# Altium schematic sheet Interface.SchDoc
size B; DocumentNumber: 3; SheetNumber: 3; SheetTotal: 9; ENG_APP_DATE: --/--/--; DSN_APP_DATE: --/--/--; CHK_APP_DATE: --/--/--
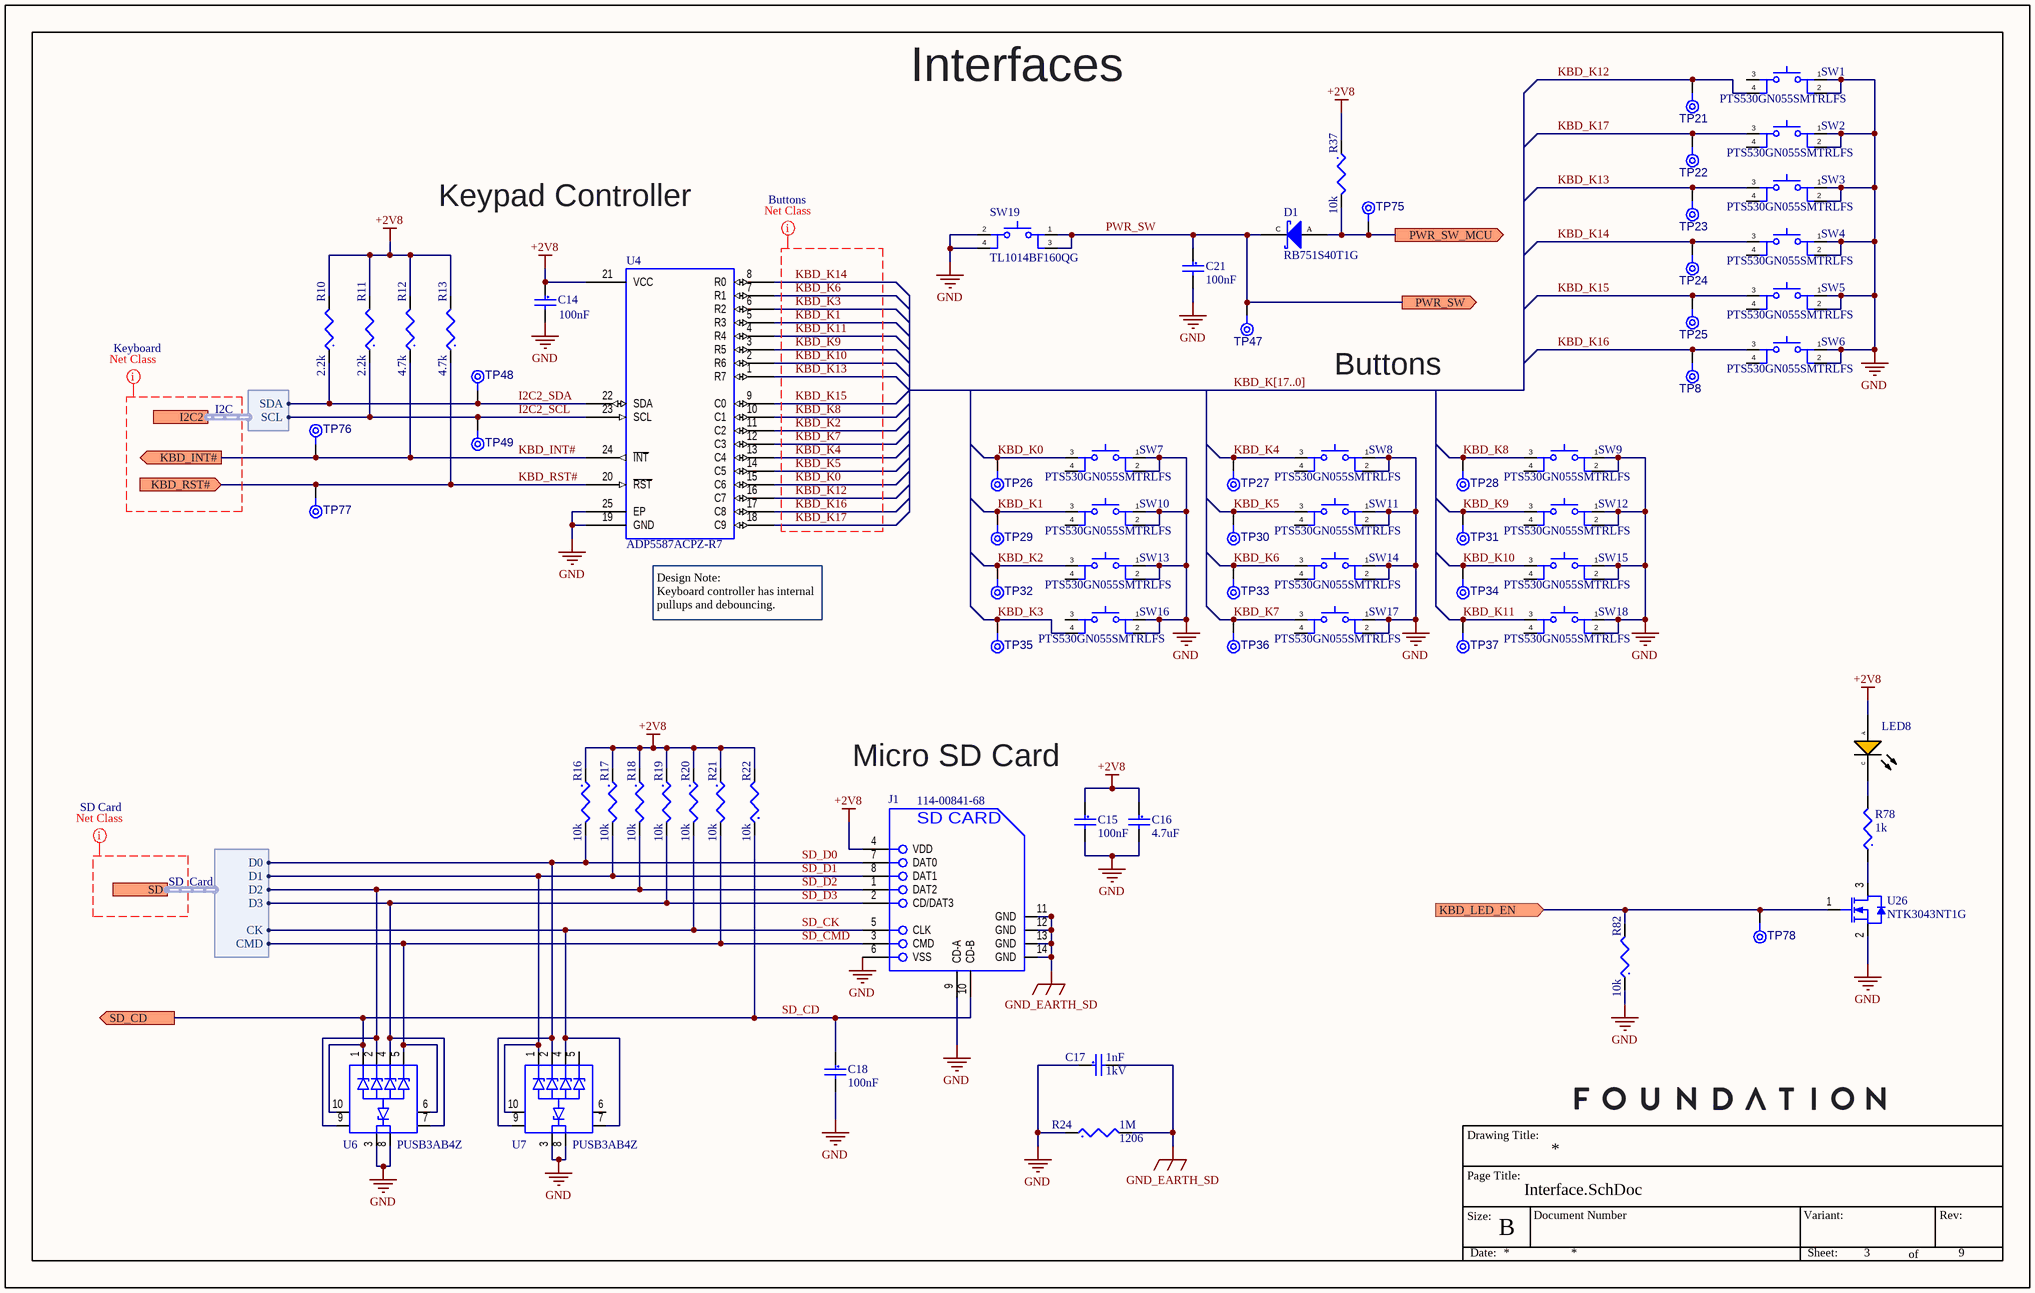
[diagram p0: Interface.SchDoc]

## Parts
C14  Capacitance: 100nF  [CAPC0402(1005)55_L]  (hidden comment: CAP CER 0.1uF 16V 10% X7R 0402)
C15  Capacitance: 100nF  [CAPC0402(1005)55_L]  (hidden comment: CAP CER 0.1uF 16V 10% X7R 0402)
C16  Capacitance: 4.7uF  [CAPC0402(1005)55_L]  (hidden comment: CAP CER 4.7UF 10V 20% X5R 0402)
C17  Capacitance: 1nF  Voltage Rating (DC): 1kV  [CAPC0805(2012)145_N]  (hidden comment: CAP CER 1000pF 1000V 10% X7R 0805)
C18  Capacitance: 100nF  [CAPC0402(1005)55_L]  (hidden comment: CAP CER 0.1uF 16V 10% X7R 0402)
C21  Capacitance: 100nF  [CAPC0402(1005)55_L]  (hidden comment: CAP CER 0.1uF 16V 10% X7R 0402)
D1  RB751S40T1G  [ON - SOD-523_V]
J1  114-00841-68  [AMPH - 114-00841-68_C-1]
LED8  IN-S63AT5A  [LEDC0603(1608)65_L]  (value not drawn)
R10  Resistance: 2.2k  [RESC0402(1005)_L]  (hidden comment: RES 2.2K 1/16W 1% 0402)
R11  Resistance: 2.2k  [RESC0402(1005)_L]  (hidden comment: RES 2.2K 1/16W 1% 0402)
R12  Resistance: 4.7k  [RESC0402(1005)_L]  (hidden comment: RES 4.7K 1/16W 1% 0402)
R13  Resistance: 4.7k  [RESC0402(1005)_L]  (hidden comment: RES 4.7K 1/16W 1% 0402)
R16  Resistance: 10k  [RESC0402(1005)_L]  (hidden comment: RES 10K 1/16W 1% 0402)
R17  Resistance: 10k  [RESC0402(1005)_L]  (hidden comment: RES 10K 1/16W 1% 0402)
R18  Resistance: 10k  [RESC0402(1005)_L]  (hidden comment: RES 10K 1/16W 1% 0402)
R19  Resistance: 10k  [RESC0402(1005)_L]  (hidden comment: RES 10K 1/16W 1% 0402)
R20  Resistance: 10k  [RESC0402(1005)_L]  (hidden comment: RES 10K 1/16W 1% 0402)
R21  Resistance: 10k  [RESC0402(1005)_L]  (hidden comment: RES 10K 1/16W 1% 0402)
R22  Resistance: 10k  [RESC0402(1005)_L]  (hidden comment: RES 10K 1/16W 1% 0402)
R24  Resistance: 1M  Case Code (Imperial): 1206  [RESC1206(3216)_L]  (hidden comment: RES 1.0M 1/4W 5% 1206)
R37  Resistance: 10k  [RESC0402(1005)_L]  (hidden comment: RES 10K 1/16W 1% 0402)
R78  Resistance: 1k  [RESC0402(1005)_L]  (hidden comment: RES 1.0K 1/16W 1% 0402)
R82  Resistance: 10k  [RESC0402(1005)_L]  (hidden comment: RES 10K 1/16W 1% 0402)
SW1  PTS530GN055SMTRLFS  [C&K - PTS530_V]
SW2  PTS530GN055SMTRLFS  [C&K - PTS530_V]
SW3  PTS530GN055SMTRLFS  [C&K - PTS530_V]
SW4  PTS530GN055SMTRLFS  [C&K - PTS530_V]
SW5  PTS530GN055SMTRLFS  [C&K - PTS530_V]
SW6  PTS530GN055SMTRLFS  [C&K - PTS530_V]
SW7  PTS530GN055SMTRLFS  [C&K - PTS530_V]
SW8  PTS530GN055SMTRLFS  [C&K - PTS530_V]
SW9  PTS530GN055SMTRLFS  [C&K - PTS530_V]
SW10  PTS530GN055SMTRLFS  [C&K - PTS530_V]
SW11  PTS530GN055SMTRLFS  [C&K - PTS530_V]
SW12  PTS530GN055SMTRLFS  [C&K - PTS530_V]
SW13  PTS530GN055SMTRLFS  [C&K - PTS530_V]
SW14  PTS530GN055SMTRLFS  [C&K - PTS530_V]
SW15  PTS530GN055SMTRLFS  [C&K - PTS530_V]
SW16  PTS530GN055SMTRLFS  [C&K - PTS530_V]
SW17  PTS530GN055SMTRLFS  [C&K - PTS530_V]
SW18  PTS530GN055SMTRLFS  [C&K - PTS530_V]
SW19  TL1014BF160QG  [E-SWITCH - TL1014BFXXXQG]
TP8  TPAD8R  [TP08R]  (value not drawn)  (no BOM)
TP21  TPAD8R  [TP08R]  (value not drawn)  (no BOM)
TP22  TPAD8R  [TP08R]  (value not drawn)  (no BOM)
TP23  TPAD8R  [TP08R]  (value not drawn)  (no BOM)
TP24  TPAD8R  [TP08R]  (value not drawn)  (no BOM)
TP25  TPAD8R  [TP08R]  (value not drawn)  (no BOM)
TP26  TPAD8R  [TP08R]  (value not drawn)  (no BOM)
TP27  TPAD8R  [TP08R]  (value not drawn)  (no BOM)
TP28  TPAD8R  [TP08R]  (value not drawn)  (no BOM)
TP29  TPAD8R  [TP08R]  (value not drawn)  (no BOM)
TP30  TPAD8R  [TP08R]  (value not drawn)  (no BOM)
TP31  TPAD8R  [TP08R]  (value not drawn)  (no BOM)
TP32  TPAD8R  [TP08R]  (value not drawn)  (no BOM)
TP33  TPAD8R  [TP08R]  (value not drawn)  (no BOM)
TP34  TPAD8R  [TP08R]  (value not drawn)  (no BOM)
TP35  TPAD8R  [TP08R]  (value not drawn)  (no BOM)
TP36  TPAD8R  [TP08R]  (value not drawn)  (no BOM)
TP37  TPAD8R  [TP08R]  (value not drawn)  (no BOM)
TP47  TPAD8R  [TP08R]  (value not drawn)  (no BOM)
TP48  TPAD8R  [TP08R]  (value not drawn)  (no BOM)
TP49  TPAD8R  [TP08R]  (value not drawn)  (no BOM)
TP75  TPAD8R  [TP08R]  (value not drawn)  (no BOM)
TP76  TPAD8R  [TP08R]  (value not drawn)  (no BOM)
TP77  TPAD8R  [TP08R]  (value not drawn)  (no BOM)
TP78  TPAD8R  [TP08R]  (value not drawn)  (no BOM)
U4  ADP5587ACPZ-R7  [ADEV - LFCSP-24_L]
U6  PUSB3AB4Z  [NEXP - DFN2510A-10_L]
U7  PUSB3AB4Z  [NEXP - DFN2510A-10_L]
U26  NTK3043NT1G  [SOT-723-3(40)_N]

## Ports
I2C2 (harness I2C), KBD_INT# (out), KBD_LED_EN (in), KBD_RST# (in), PWR_SW (out), PWR_SW_MCU (out), SD (harness SD_Card), SD_CD (out)

## Harnesses
SD_Card: CK, CMD, D0, D1, D2, D3
I2C: SCL, SDA

## Nets
+2V8: C14.1 C15.1 C16.1 J1.4(VDD) LED8.A R10.2 R11.2 R12.2 R13.2 R16.1 R17.1 R18.1 R19.1 R20.1 R21.1 R22.2 R37.1 U4.21(VCC)
GND: C14.2 C15.2 C16.2 C17.1 C18.2 C21.2 J1.6(VSS) J1.9(CD-A) R24.1 R82.1 SW1.1 SW1.2 SW2.1 SW2.2 SW3.1 SW3.2 SW4.1 SW4.2 SW5.1 SW5.2 SW6.1 SW6.2 SW7.1 SW7.2 SW8.1 SW8.2 SW9.1 SW9.2 SW10.1 SW10.2 SW11.1 SW11.2 SW12.1 SW12.2 SW13.1 SW13.2 SW14.1 SW14.2 SW15.1 SW15.2 SW16.1 SW16.2 SW17.1 SW17.2 SW18.1 SW18.2 SW19.2 SW19.4 U4.19(GND) U4.25(EP) U6.3(DIODE) U6.8(DIODE) U7.3(DIODE) U7.8(DIODE) U26.2(S)
GND_EARTH_SD: C17.2 J1.11(GND) J1.12(GND) J1.13(GND) J1.14(GND) R24.2
I2C2_SCL: R11.1 TP49.1(TP) U4.23(SCL) ; port I2C2.SCL
I2C2_SDA: R10.1 TP48.1(TP) U4.22(SDA) ; port I2C2.SDA
KBD_INT#: R12.1 TP76.1(TP) U4.24(~{INT}) ; port KBD_INT#
KBD_K0: SW7.3 TP26.1(TP) U4.15(C6)
KBD_K1: SW10.3 TP29.1(TP) U4.5(R3)
KBD_K2: SW13.3 TP32.1(TP) U4.11(C2)
KBD_K3: SW16.4 TP35.1(TP) U4.6(R2)
KBD_K4: SW8.3 TP27.1(TP) U4.13(C4)
KBD_K5: SW11.3 TP30.1(TP) U4.14(C5)
KBD_K6: SW14.3 TP33.1(TP) U4.7(R1)
KBD_K7: SW17.3 TP36.1(TP) U4.12(C3)
KBD_K8: SW9.3 TP28.1(TP) U4.10(C1)
KBD_K9: SW12.3 TP31.1(TP) U4.3(R5)
KBD_K10: SW15.3 TP34.1(TP) U4.2(R6)
KBD_K11: SW18.3 TP37.1(TP) U4.4(R4)
KBD_K12: SW1.4 TP21.1(TP) U4.16(C7)
KBD_K13: SW3.3 TP23.1(TP) U4.1(R7)
KBD_K14: SW4.3 TP24.1(TP) U4.8(R0)
KBD_K15: SW5.3 TP25.1(TP) U4.9(C0)
KBD_K16: SW6.3 TP8.1(TP) U4.17(C8)
KBD_K17: SW2.3 TP22.1(TP) U4.18(C9)
KBD_LED_EN: R82.2 TP78.1(TP) U26.1(G) ; port KBD_LED_EN
KBD_RST#: R13.1 TP77.1(TP) U4.20(~{RST}) ; port KBD_RST#
PWR_SW: C21.1 D1.C SW19.1 SW19.3 TP47.1(TP) ; port PWR_SW
PWR_SW_MCU: D1.A R37.2 TP75.1(TP) ; port PWR_SW_MCU
SD_CD: C18.1 J1.10(CD-B) R22.1 U6.1(DIODE) U6.10(DIODE) ; port SD_CD
SD_CK: J1.5(CLK) R20.2 U7.4(DIODE) U7.7(DIODE) ; port SD.CK
SD_CMD: J1.3(CMD) R21.2 U6.5(DIODE) U6.6(DIODE) ; port SD.CMD
SD_D0: J1.7(DAT0) R16.2 U7.2(A) U7.9(DIODE) ; port SD.D0
SD_D1: J1.8(DAT1) R17.2 U7.1(DIODE) U7.10(DIODE) ; port SD.D1
SD_D2: J1.1(DAT2) R18.2 U6.2(A) U6.9(DIODE) ; port SD.D2
SD_D3: J1.2(CD/DAT3) R19.2 U6.4(DIODE) U6.7(DIODE) ; port SD.D3
NetLED8_C: LED8.C R78.2
NetR78_1: R78.1 U26.3(D)

Not connected (* = marked no-connect by the designer): SW1 3; SW2 4; SW3 4; SW4 4; SW5 4; SW6 4; SW7 4; SW8 4; SW9 4; SW10 4; SW11 4; SW12 4; SW13 4; SW14 4; SW15 4; SW16 3; SW17 4; SW18 4; U7 5(DIODE) 6(DIODE)

## Buses and harness runs
bus KBD_K[17..0]

## Layout directives
net class Keyboard: (no net found under the mark)
net class SD Card: (no net found under the mark)
net class Buttons: KBD_K0, KBD_K1, KBD_K2, KBD_K3, KBD_K4, KBD_K5, KBD_K6, KBD_K7, KBD_K8, KBD_K9, KBD_K10, KBD_K11, KBD_K12, KBD_K13, KBD_K14, KBD_K15, KBD_K16, KBD_K17

## Notes on the sheet
- Interfaces
- Keypad Controller
- Buttons
- (near U4) Design Note:
  Keyboard controller has internal pullups and debouncing.
- Micro SD Card
- Drawing Title:
- Page Title:
- Size:
- B
- Document Number
- Variant:
- Rev:
- Date:
- Sheet:
- of
- (in symbol CMP-CON-0078-2) SD CARD

## Library data of the parts
C14 C15 C18 C21 = CMP-CAP-00002-2: 0.1µF ±10% 16V Ceramic Capacitor X7R 0402 (1005 Metric); Insulation Resistance: 10GR; Material: Ceramic; Tolerance: 10%; REACH SVHC: No SVHC; Radiation Hardening: No; Case Code (Metric): 1005; Height: 0.5mm; Depth: 0.5mm; Min Operating Temperature: -55°C; Max Operating Temperature: 125°C; Lead Free: Lead Free; Thickness: 0.022inch; Length: 1mm; Voltage Rating (DC): 16V; Dielectric Material: Ceramic; Packaging: Tape and Reel; Case/Package: 0402; Width: 0.5mm; Termination: SMD/SMT; Voltage Rating: 16V; Mount: Surface Mount; Case Code (Imperial): 0402; Package Quantity: 1; Dielectric: X7R; Number of Pins: 2; Voltage: 16V
C16 = CMP-CAP-00038-1: 4.7µF ±20% 10V Ceramic Capacitor X5R 0402 (1005 Metric); Length: 1mm; Termination: SMD/SMT; Max Operating Temperature: 85°C; Case Code (Imperial): 0402; Height: 0.5mm; Voltage Rating: 10V; Composition: Ceramic; Dielectric: X5R; Voltage Rating (DC): 10V; REACH SVHC: No SVHC; Case Code (Metric): 1005; Tolerance: 20%; Case/Package: 0402; Min Operating Temperature: -55°C; Width: 0.02inch; Mount: Surface Mount; Packaging: Tape and Reel; Package Quantity: 1; Thickness: 500um; Radiation Hardening: No; Voltage: 10V; Depth: 0.5mm; Weight: 2.3E-05oz; Dielectric Material: Ceramic; Lead Free: Lead Free
C17 = CMP-CAP-00004-1: 1000pF ±10% 1000V (1kV) Ceramic Capacitor X7R 0805 (2012 Metric); Insulation Resistance: 100GR; Mount: Surface Mount; Width: 1.25mm; Voltage Rating: 1kV; Number of Pins: 2; Packaging: Tape and Reel; Package Quantity: 4000; Termination: SMD/SMT; Height: 1.3mm; Case Code (Metric): 2012; Depth: 1.25mm; Dielectric: X7R; Thickness: 0.051inch; Length: 2.01mm; Case Code (Imperial): 0805; Contact Plating: Nickel,Tin,Matte; Dissipation Factor: 10%; Tolerance: 10%; Case/Package: 0805; Min Operating Temperature: -55°C; REACH SVHC: No SVHC; Lead Free: Lead Free; Dielectric Material: Ceramic; Max Operating Temperature: 125°C
D1 = CMP-DIO-0007-1: Diode Schottky 30V 30mA (DC) Surface Mount SOD-523; Voltage Rating (DC): 40V; Peak Non-Repetitive Surge Current: 500mA; Peak Reverse Current: 500nA; Element Configuration: Single; Capacitance: 2.5pF; Power Dissipation: 200mW; Polarity: Standard; Forward Voltage: 370mV; Radiation Hardening: No; Min Operating Temperature: -55°C; Current Rating: 30mA; Forward Current: 30mA; Number of Pins: 2; Average Rectified Current: 30mA; Output Current: 30mA; Max Operating Temperature: 150°C; Width: 0.9mm; ComponentLink1Description: Datasheet; Length: 1.3mm; Max Surge Current: 500mA; Max Reverse Voltage (DC): 30V; REACH SVHC: No SVHC; Lead Free: Lead Free; Max Reverse Leakage Current: 500nA; Max Forward Surge Current (Ifsm): 500mA; Package Quantity: 1; ComponentLink1URL: https://www.onsemi.cn/PowerSolutions/document/RB751S40T1-D.PDF; Max Repetitive Reverse Voltage (Vrrm): 40V; Contact Plating: Tin,Matte; Case/Package: SOD-523-2; Height: 0.7mm; Packaging: Tape and Reel
J1 = CMP-CON-0078-2: 10 (8 + 2) Position Card Connector Secure Digital - microSD™ Surface Mount, Right Angle Gold; ComponentLink1URL: https://media.digikey.com/pdf/Data%20Sheets/Amphenol%20PDFs/114-00841-68.pdf; ComponentLink1Description: Drawing
LED8 = CMP-007-00047-1: Amber 605nm LED Indication - Discrete 1.9V 0603 (1608 Metric); Forward Voltage: 1.9V; Colour: Amber; ComponentLink1Description: Datasheet; ComponentLink1URL: http://www.inolux-corp.com/datasheet/SMDLED/Mono%20Color%20Top%20View/IN-S63AT%20Series_V1.1.pdf
R10 R11 = CMP-RES-00049-1: 2.2 kOhms ±1% 0.063W, 1/16W Chip Resistor 0402 (1005 Metric); Power Rating: 63mW; Temperature Coefficient: 100ppm/°C; Voltage Rating: 50V; Weight: 2.3E-05oz; Military Standard: Not; Termination: SMD/SMT; Max Operating Temperature: 155°C; Case Code (Metric): 1005; Case Code (Imperial): 0402; REACH SVHC: Unknown; Min Operating Temperature: -55°C; Tolerance: 1%; Width: 0.5mm; Depth: 0.5mm; Length: 1mm; Case/Package: 0402; Height: 0.35mm; Packaging: Tape and Reel; Lead Free: Lead Free; Composition: Thick Film
R12 R13 = CMP-RES-00002-3: 4.7 kOhms ±1% 0.063W, 1/16W Chip Resistor 0402 (1005 Metric) Automotive AEC-Q200 Thick Film; Max Power Dissipation: 63mW; Voltage Rating (DC): 50V; Temperature Coefficient: 100ppm/°C; Weight: 2.3E-05oz; Package Quantity: 10; Military Standard: Not; Contact Plating: Tin; Termination: SMD/SMT; Max Operating Temperature: 155°C; Case Code (Metric): 1005; Case Code (Imperial): 0402; Features: Automotive AEC-Q200; Power Rating: 63mW; REACH SVHC: Unknown; Min Operating Temperature: -55°C; Tolerance: 1%; Mount: Surface Mount; Width: 0.5mm; Depth: 0.5mm; Radiation Hardening: No; Length: 1mm; Number of Terminations: 2; Case/Package: 0402; Voltage Rating: 50V; Height: 0.35mm; Packaging: Tape and Reel; Lead Free: Lead Free; Composition: Thick Film
R16-R21 R37 = CMP-RES-00006-3: 10 kOhms ±1% 0.063W, 1/16W Chip Resistor 0402 (1005 Metric); Voltage Rating (DC): 50V; Power Rating: 63mW; Temperature Coefficient: 100ppm/°C; Case Code (Imperial): 0402; Mount: Surface Mount; Composition: Thick Film; Features: Automotive AEC-Q200; Depth: 0.5mm; Height: 0.35mm; Weight: 2.3E-05oz; Number of Pins: 2; Termination: SMD/SMT; Min Operating Temperature: -55°C; Length: 1mm; Package Quantity: 10; Lead Free: Lead Free; Radiation Hardening: No; Max Operating Temperature: 155°C; Voltage Rating: 50V; Military Standard: Not; Case/Package: 0402; Contact Plating: Tin; Max Power Dissipation: 63mW; Tolerance: 1%; Case Code (Metric): 1005; Number of Terminations: 2; Packaging: Tape and Reel; REACH SVHC: Unknown; Width: 0.02inch
R22 R82 = CMP-RES-00006-3: 10 kOhms ±1% 0.063W, 1/16W Chip Resistor 0402 (1005 Metric); Max Power Dissipation: 63mW; Voltage Rating (DC): 50V; Temperature Coefficient: 100ppm/°C; Width: 0.02inch; Power Rating: 63mW; Case/Package: 0402; Min Operating Temperature: -55°C; Number of Terminations: 2; Lead Free: Lead Free; Features: Automotive AEC-Q200; Number of Pins: 2; Tolerance: 1%; Height: 0.35mm; Mount: Surface Mount; Radiation Hardening: No; Length: 1mm; Case Code (Metric): 1005; Weight: 2.3E-05oz; Military Standard: Not; Depth: 0.5mm; Package Quantity: 10; Max Operating Temperature: 155°C; Termination: SMD/SMT; Case Code (Imperial): 0402; Contact Plating: Tin; Voltage Rating: 50V; Composition: Thick Film; Packaging: Tape and Reel; REACH SVHC: Unknown
R24 = CMP-RES-00004-3: 1 MOhms ±5% 0.25W, 1/4W Chip Resistor 1206 (3216 Metric) Moisture Resistant Thick Film; Power Rating: 250mW; Temperature Coefficient: 200ppm/°C; Voltage Rating: 200V; Mount: Surface Mount; Radiation Hardening: No; Tolerance: 5%; Military Standard: Not; Termination: SMD/SMT; Case Code (Metric): 3216; Depth: 1.6mm; Case/Package: 1206; REACH SVHC: No SVHC; Height: 0.6mm; Max Operating Temperature: 155°C; Package Quantity: 5000; Thickness: 610um; Min Operating Temperature: -55°C; Voltage Rating (DC): 200V; Length: 3.2mm; Composition: Thick Film; Width: 1.6mm; Packaging: Tape and Reel; Contact Plating: Tin
R78 = CMP-RES-00000-3: 1 kOhms ±0.5% 0.063W, 1/16W Chip Resistor 0402 (1005 Metric) Automotive AEC-Q200 Thin Film; Max Power Dissipation: 63mW; Power Rating: 62.5mW; Voltage Rating (DC): 25V; Temperature Coefficient: 25ppm/°C; Width: 0.5mm; Case/Package: 0402; Min Operating Temperature: -55°C; Number of Terminations: 2; Lead Free: Lead Free; Tolerance: 0.5%; Height: 0.016inch; Mount: Surface Mount; Radiation Hardening: No; Length: 1mm; Case Code (Metric): 1005; Weight: 2.8E-05oz; Military Standard: Not; Depth: 0.5mm; Package Quantity: 10000; Max Operating Temperature: 155°C; Termination: SMD/SMT; Case Code (Imperial): 0402; Contact Plating: Tin; Voltage Rating: 25V; Composition: Metal Film,Thin Film; Packaging: Tape and Reel; REACH SVHC: No SVHC
SW1-SW18 = CMP-SWH-00003-1: Tactile Switch SPST-NO Top Actuated Surface Mount; Manufacturer Series: PTS530; Contact DC Max Rating R Load: 0.05A@12VDC; Dielectric Withstand Volts: 250VACV; Body Height: 0.5588mm; Switch Action: MOMENTARY; Contact Voltage(DC)-Max: 12V; Actuator Travel: 0.2032mm; Electrical Life: 1000000Cycles; Body Length or Diameter: 4.4958mm; Switch Type: Keypad; Contact Current(DC)-Max: 50mA; Actuator Type: Pushbutton; Contact Resistance: 0.05mR; Insulation Resistance: 100MR; Body Breadth: 4.4958inch; Switch Function: SPST; Min Operating Temperature: -40°C; Max Operating Temperature: 85°C; RoHS Compliant: Yes; Mount: Surface Mount; ComponentLink1URL: https://www.ckswitches.com/media/1469/pts530.pdf; Termination: Solder; ComponentLink1Description: Datasheet; REACH SVHC: Yes; JESD-609 Code: e4; Terminal Finish: Silver
SW19 = CMP-SWH-00004-1: Tactile Switch SPST-NO Side Actuated Surface Mount, Right Angle; Switch Type: Keypad; ComponentLink1Description: Drawing; ComponentLink1URL: http://spec_sheets.e-switch.com/specs/P410002.pdf; JESD-609 Code: e4; REACH SVHC: Yes; Terminal Finish: Silver; RoHS Compliant: Yes
TP8 TP21-TP37 TP47-TP49 TP75-TP78 = CMP-MECH-00011-2: 0.8mm round; Pins: 1
U4 = CMP-IC-INT-0000-10: I/O Expander 18 I²C 400kHz 24-LFCSP-WQ (4x4); Max Supply Voltage: 3.6V; Number of I/Os: 18; Nominal Supply Current: 200uA; Min Supply Voltage: 1.65V; Interface: I2C; Number of Pins: 24; REACH SVHC: No SVHC; Case/Package: 24-LFCSP-WQ (4x4); Max Operating Temperature: 85°C; Package Quantity: 1500; Min Operating Temperature: -40°C; Frequency: 400kHz; Packaging: Tape and Reel; Mount: Surface Mount; Lead Free: Contains Lead; Max Frequency: 400kHz; ComponentLink1URL: https://www.analog.com/media/en/technical-documentation/data-sheets/ADP5587.pdf; ComponentLink1Description: Datasheet; Max Supply Current: 200uA
U6 U7 = CMP-DIO-0006-4: TVS DIODE 3.3V 5V DFN2510A-10; Capacitance @ Frequency: 0.17pF @ 1MHz; Bidirectional Channels: 4; Type: Zener; Max Operating Temperature: 85°C; Min Operating Temperature: -40°C; Case/Package: DFN2510A-10; ComponentLink1Description: Datasheet; ComponentLink1URL: https://assets.nexperia.com/documents/data-sheet/PUSB3AB4.pdf
U26 = CMP-TRNST-0003-1: N-Channel 20V 210mA (Ta) 310mW (Ta) Surface Mount SOT-723; Power Dissipation: 440mW; Gate to Source Voltage (Vgs): 10V; Drain to Source Resistance: 3.4R; Input Capacitance: 11pF; Turn-On Delay Time: 13ns; Vgs(th) (Max) @ Id: 1.3V @ 250µA; Turn-Off Delay Time: 94ns; Rise Time: 15ns; Number of Elements: 1; Element Configuration: Single; Current Rating: 225mA; Threshold Voltage: 400mV; Max Operating Temperature: 150°C; Package Quantity: 1; Packaging: Tape and Reel; Continuous Drain Current (ID): 210mA; Pins: 3; Min Operating Temperature: -55°C; Vgs (Max): 10V; Drain to Source Breakdown Voltage: 20V; Radiation Hardening: No; Mounting Technology: Surface Mount; Drain to Source Voltage (Vdss): 20V; Number of Pins: 3; Max Power Dissipation: 310mW; Fall Time: 15ns; Case/Package: SOT-723-3; Transistor Type: N-Channel; Rds On Max: 3.4R; Lead Free: Lead Free; Height: 0.55mm; Contact Plating: Tin,Matte; On-State Resistance: 3.4R; Length: 1.25mm; REACH SVHC: No SVHC; Width: 0.85mm; Voltage Rating (DC): 20V